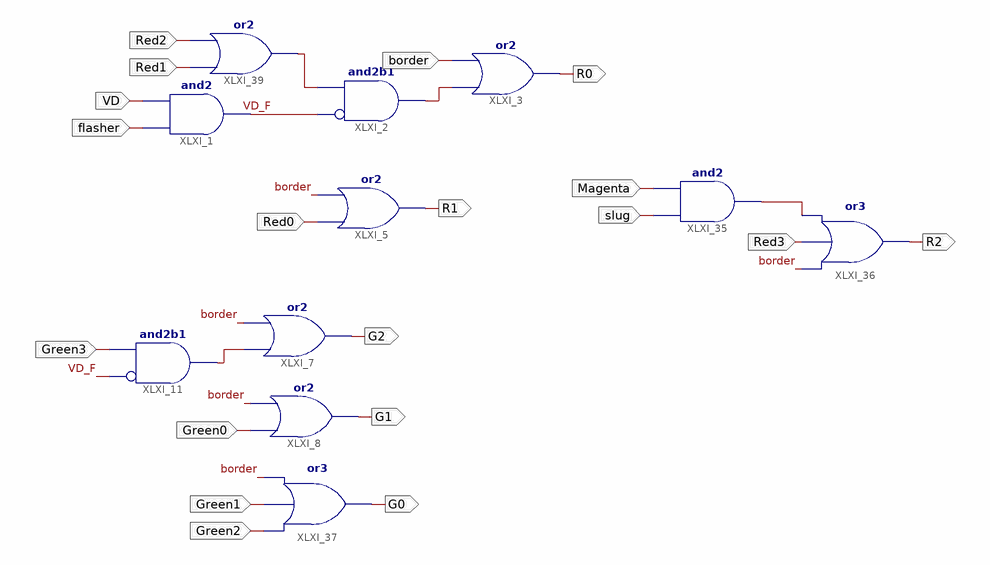
[diagram p0: schematic sheet 1]
// Xilinx ISE schematic Color_Logic.sch (spartan3e) as structural Verilog: 11 symbols, 19 ports
module Color_Logic (
  input  border,
  input  flasher,
  input  VD,
  input  Magenta,
  input  slug,
  input  Red2,
  input  Red1,
  input  Red3,
  input  Green3,
  input  Green0,
  input  Green1,
  input  Green2,
  input  Red0,
  output R0,
  output R1,
  output R2,
  output G2,
  output G1,
  output G0
);

  wire VD_F, XLXN_4, XLXN_20, XLXN_75, XLXN_89;

  and XLXI_1 (VD_F, flasher, VD);
  and XLXI_2 (XLXN_4, ~VD_F, XLXN_89);  // and2b1
  or XLXI_3 (R0, XLXN_4, border);
  or XLXI_5 (R1, Red0, border);
  and XLXI_35 (XLXN_75, slug, Magenta);
  or XLXI_36 (R2, border, Red3, XLXN_75);
  or XLXI_39 (XLXN_89, Red1, Red2);
  and XLXI_11 (XLXN_20, ~VD_F, Green3);  // and2b1
  or XLXI_7 (G2, XLXN_20, border);
  or XLXI_8 (G1, Green0, border);
  or XLXI_37 (G0, Green2, Green1, border);
endmodule
